# Altium project S32K118_DEVELOPMENT_BOARD.PrjPcb
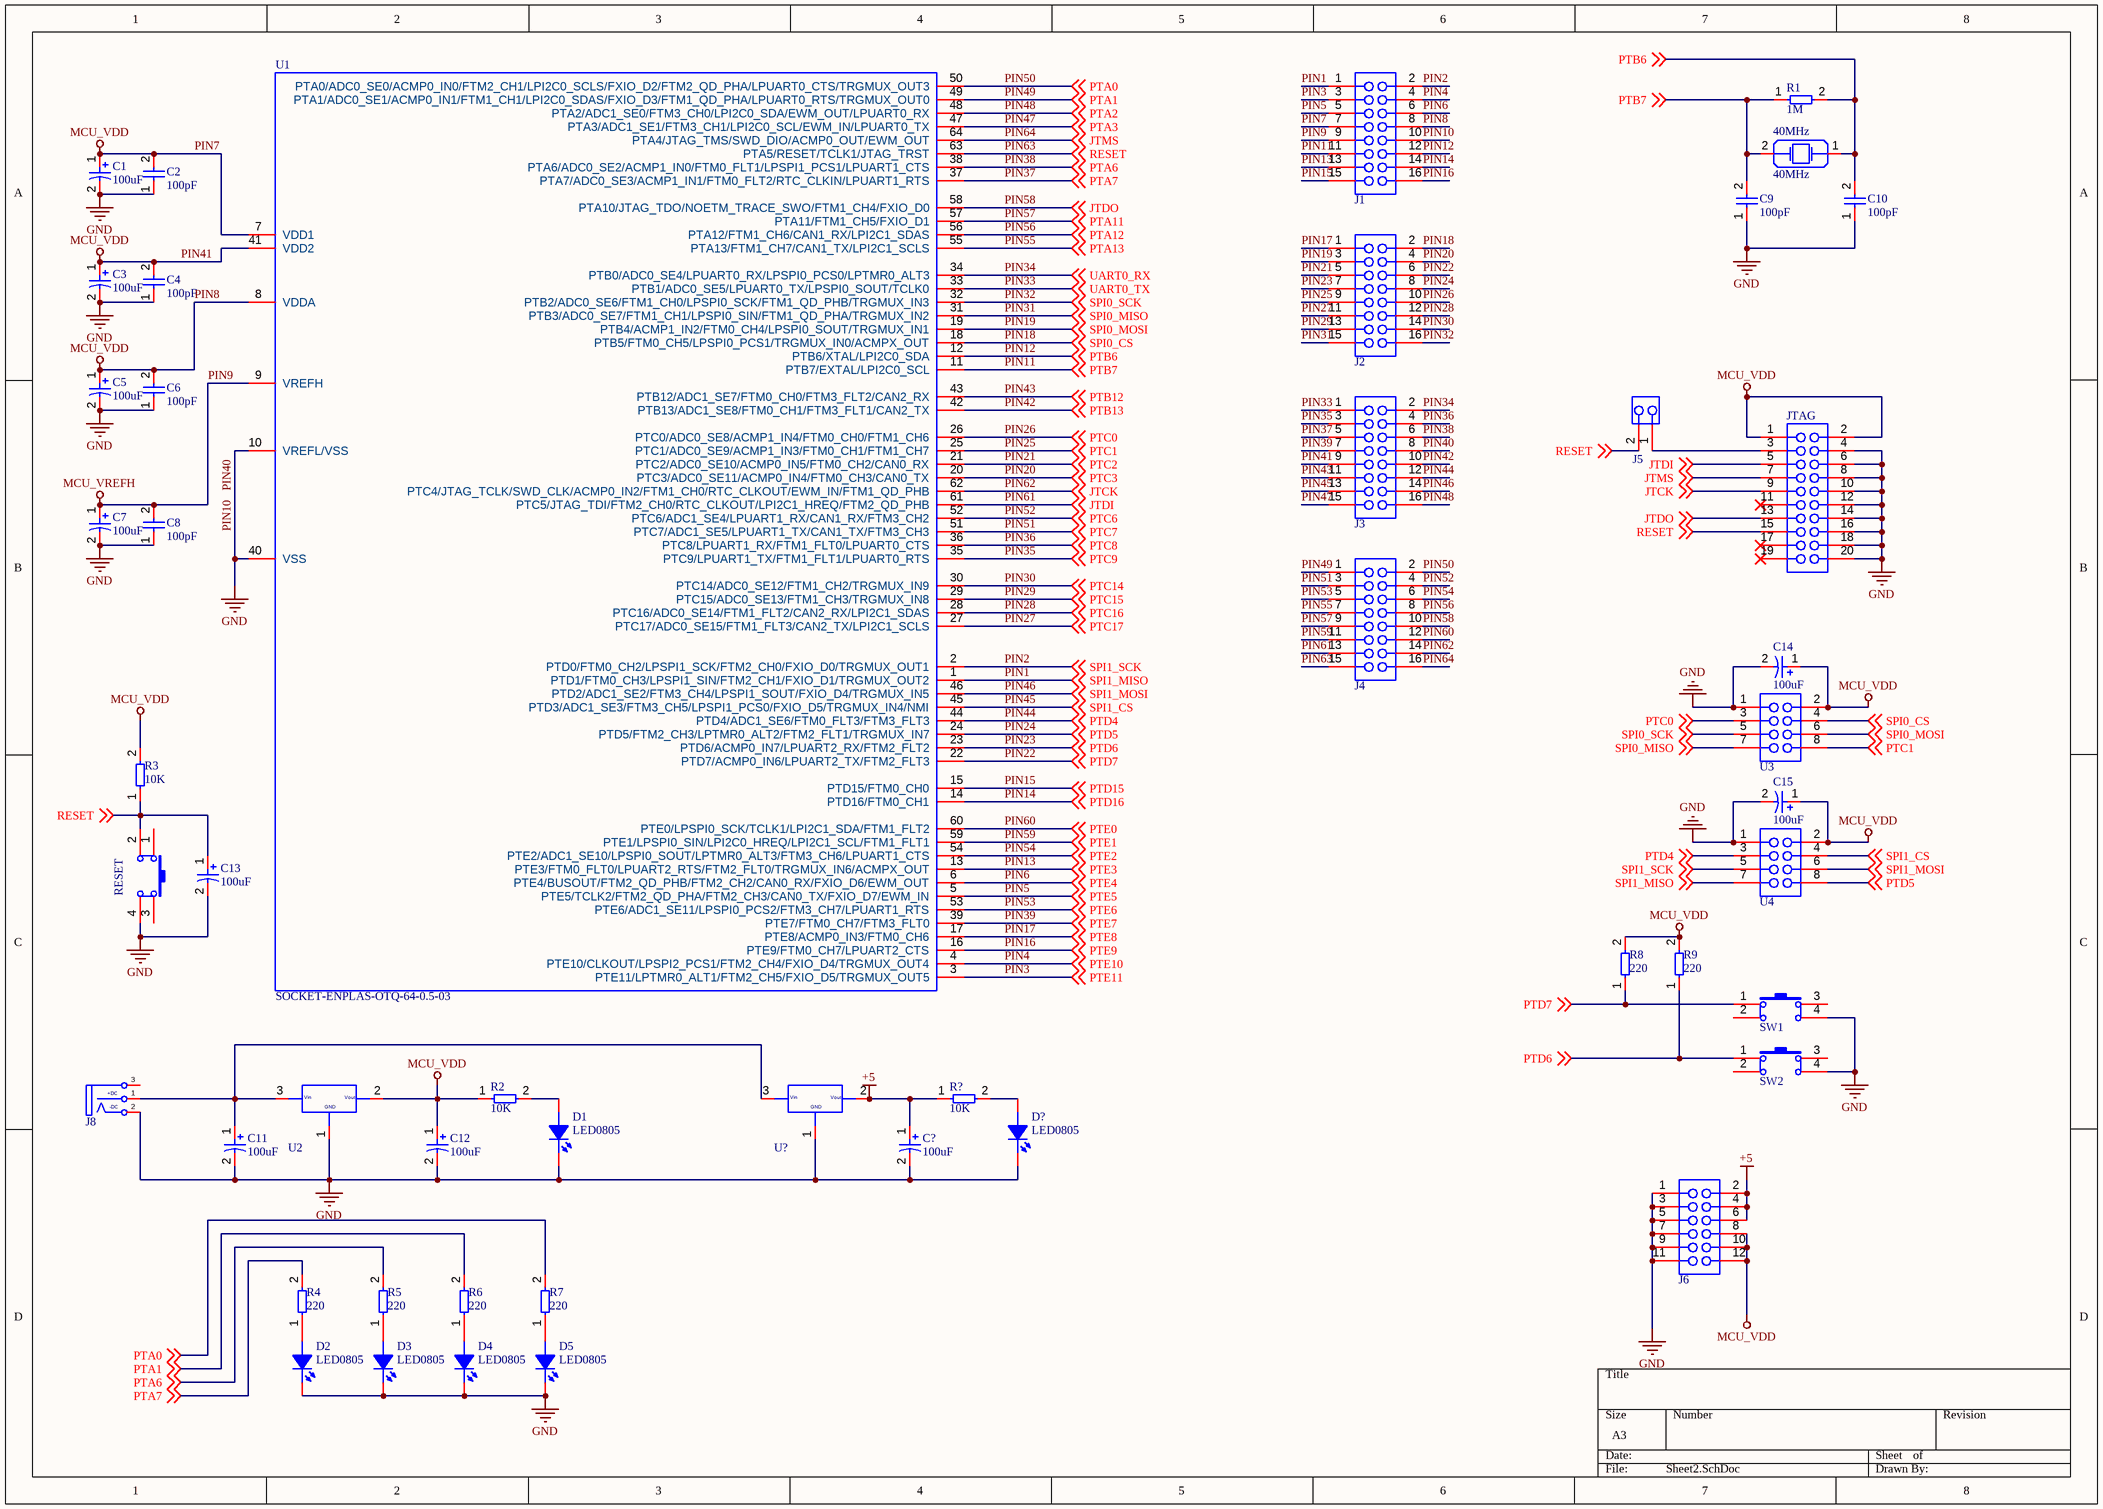
[diagram p0: Sheet2.SchDoc]
1 sheet, 49 parts. Net scope: global (net labels, ports and power ports of the same name join across sheets).
Board file: PCB2.PcbDoc

## Sheet Sheet2.SchDoc
size A3

### Parts
40MHz  40MHz  [HC-49_THROUGH]
C1  100uF  [CAP_RAD_4mm]
C2  100pF  [CAP_DISC_PITCH_2.54MM]
C3  100uF  [CAP_RAD_4mm]
C4  100pF  [CAP_DISC_PITCH_2.54MM]
C5  100uF  [CAP_RAD_4mm]
C6  100pF  [CAP_DISC_PITCH_2.54MM]
C7  100uF  [CAP_RAD_4mm]
C8  100pF  [CAP_DISC_PITCH_2.54MM]
C9  100pF  [CAP_DISC_PITCH_2.54MM]
C10  100pF  [CAP_DISC_PITCH_2.54MM]
C11  100uF  [CAP_RAD_4mm]
C12  100uF  [CAP_RAD_4mm]
C13  100uF  [CAP_RAD_4mm]
C14  100uF  [CAP_RAD_4mm]
C15  100uF  [CAP_RAD_4mm]
C16  100uF  [CAP_RAD_4mm]
D1  LED0805  [L0805RED]
D2  LED0805  [L0805RED]
D3  LED0805  [L0805RED]
D4  LED0805  [L0805RED]
D5  LED0805  [L0805RED]
D6  LED0805  [L0805RED]
J1  Header 8x2 TH Pitch 2.54mm  [Header 8x2 TH Pitch 2.54mm]  (value not drawn)
J2  Header 8x2 TH Pitch 2.54mm  [Header 8x2 TH Pitch 2.54mm]  (value not drawn)
J3  Header 8x2 TH Pitch 2.54mm  [Header 8x2 TH Pitch 2.54mm]  (value not drawn)
J4  Header 8x2 TH Pitch 2.54mm  [Header 8x2 TH Pitch 2.54mm]  (value not drawn)
J5  Header 1x2 TH Pitch 2.54mm  [Header 2x1 TH Pitch 2.54mm]  (value not drawn)
J6  Header 6x2 TH Pitch 2.54mm  [Header 6x2 TH Pitch 2.54mm]  (value not drawn)
J8  Connector  [DC_K375A_Power]  (value not drawn)
JTAG  IDC_2.54_10x2  [IDC_CONNECTOR_20_2.54]  (value not drawn)
R1  1M  [RES-0.25W-H-MF]
R2  10K  [RES-0.25W-H-MF]
R3  10K  [RES-0.25W-H-MF]
R4  220  [R0805]
R5  220  [R0805]
R6  220  [R0805]
R7  220  [R0805]
R8  220  [R0805]
R9  220  [R0805]
R?  10K  [RES-0.25W-H-MF]
RESET  Button Hole  [BUTTON_HOLE_5.0mm]  (value not drawn)
SW1  Button Hole  [BUTTON_HOLE_5.0mm]  (value not drawn)
SW2  Button Hole  [BUTTON_HOLE_5.0mm]  (value not drawn)
U1  SOCKET-ENPLAS-OTQ-64-0.5-03  [SOCKET-ADAPTER-OTQ-64-05-03]
U2  AMS1117  [SOT223-3]  (value not drawn)
U3  nRF24L01  [Header 4x2 TH Pitch 2.54mm]  (value not drawn)
U4  nRF24L01  [Header 4x2 TH Pitch 2.54mm]  (value not drawn)
U5  AMS1117  [SOT223-3]  (value not drawn)

### Nets
+5: C16.1 J6.2 J6.4 J6.6 R?.1 U5.2
PIN9: C7.1 C8.2 J1.9 U1.9(VREFH)  [also labelled MCU_VREFH]
PIN10: C1.2 C2.1 C3.2 C4.1 C5.2 C6.1 C7.2 C8.1 C9.1 C10.1 C11.2 C12.2 C13.2 C14.2 C15.2 C16.2 D1.2(K) D2.2(K) D3.2(K) D4.2(K) D5.2(K) D6.2(K) J1.10 J3.8 J6.1 J6.3 J6.5 J6.7 J6.9 J6.11 J8.2(DC-) JTAG.4 JTAG.6 JTAG.8 JTAG.10 JTAG.12 JTAG.14 JTAG.16 JTAG.18 JTAG.20 RESET.4 SW1.4 SW2.4 U1.10(VREFL/VSS) U1.40(VSS) U2.1 U3.1 U4.1 U5.1  [also labelled GND, PIN40]
PIN41: C1.1 C2.2 C3.1 C4.2 C5.1 C6.2 C12.1 C14.1 C15.1 J1.7 J1.8 J3.9 J6.8 J6.10 J6.12 JTAG.1 JTAG.2 R2.1 R3.2 R8.2 R9.2 U1.7(VDD1) U1.8(VDDA) U1.41(VDD2) U2.2 U3.2 U4.2  [also labelled MCU_VDD, PIN7, PIN8]
PIN1: J1.1 U1.1(PTD1/FTM0_CH3/LPSPI1_SIN/FTM2_CH1/FXIO_D1/TRGMUX_OUT2) U4.7 ; off-sheet SPI1_MISO  [also labelled SPI1_MISO]
PIN2: J1.2 U1.2(PTD0/FTM0_CH2/LPSPI1_SCK/FTM2_CH0/FXIO_D0/TRGMUX_OUT1) U4.5 ; off-sheet SPI1_SCK  [also labelled SPI1_SCK]
PIN3: J1.3 U1.3(PTE11/LPTMR0_ALT1/FTM2_CH5/FXIO_D5/TRGMUX_OUT5) ; off-sheet PTE11  [also labelled PTE11]
PIN4: J1.4 U1.4(PTE10/CLKOUT/LPSPI2_PCS1/FTM2_CH4/FXIO_D4/TRGMUX_OUT4) ; off-sheet PTE10  [also labelled PTE10]
PIN5: J1.5 U1.5(PTE5/TCLK2/FTM2_QD_PHA/FTM2_CH3/CAN0_TX/FXIO_D7/EWM_IN) ; off-sheet PTE5  [also labelled PTE5]
PIN6: J1.6 U1.6(PTE4/BUSOUT/FTM2_QD_PHB/FTM2_CH2/CAN0_RX/FXIO_D6/EWM_OUT) ; off-sheet PTE4  [also labelled PTE4]
PIN11: 40MHz.2 C9.2 J1.11 R1.1 U1.11(PTB7/EXTAL/LPI2C0_SCL) ; off-sheet PTB7  [also labelled PTB7]
PIN12: 40MHz.1 C10.2 J1.12 R1.2 U1.12(PTB6/XTAL/LPI2C0_SDA) ; off-sheet PTB6  [also labelled PTB6]
PIN13: J1.13 U1.13(PTE3/FTM0_FLT0/LPUART2_RTS/FTM2_FLT0/TRGMUX_IN6/ACMPX_OUT) ; off-sheet PTE3  [also labelled PTE3]
PIN14: J1.14 U1.14(PTD16/FTM0_CH1) ; off-sheet PTD16  [also labelled PTD16]
PIN15: J1.15 U1.15(PTD15/FTM0_CH0) ; off-sheet PTD15  [also labelled PTD15]
PIN16: J1.16 U1.16(PTE9/FTM0_CH7/LPUART2_CTS) ; off-sheet PTE9  [also labelled PTE9]
PIN17: J2.1 U1.17(PTE8/ACMP0_IN3/FTM0_CH6) ; off-sheet PTE8  [also labelled PTE8]
PIN18: J2.2 U1.18(PTB5/FTM0_CH5/LPSPI0_PCS1/TRGMUX_IN0/ACMPX_OUT) U3.4 ; off-sheet SPI0_CS  [also labelled SPI0_CS]
PIN19: J2.3 U1.19(PTB4/ACMP1_IN2/FTM0_CH4/LPSPI0_SOUT/TRGMUX_IN1) U3.6 ; off-sheet SPI0_MOSI  [also labelled SPI0_MOSI]
PIN20: J2.4 U1.20(PTC3/ADC0_SE11/ACMP0_IN4/FTM0_CH3/CAN0_TX) ; off-sheet PTC3  [also labelled PTC3]
PIN21: J2.5 U1.21(PTC2/ADC0_SE10/ACMP0_IN5/FTM0_CH2/CAN0_RX) ; off-sheet PTC2  [also labelled PTC2]
PIN22: J2.6 R8.1 SW1.1 U1.22(PTD7/ACMP0_IN6/LPUART2_TX/FTM2_FLT3) ; off-sheet PTD7  [also labelled PTD7]
PIN23: J2.7 R9.1 SW2.1 U1.23(PTD6/ACMP0_IN7/LPUART2_RX/FTM2_FLT2) ; off-sheet PTD6  [also labelled PTD6]
PIN24: J2.8 U1.24(PTD5/FTM2_CH3/LPTMR0_ALT2/FTM2_FLT1/TRGMUX_IN7) U4.8 ; off-sheet PTD5  [also labelled PTD5]
PIN25: J2.9 U1.25(PTC1/ADC0_SE9/ACMP1_IN3/FTM0_CH1/FTM1_CH7) U3.8 ; off-sheet PTC1  [also labelled PTC1]
PIN26: J2.10 U1.26(PTC0/ADC0_SE8/ACMP1_IN4/FTM0_CH0/FTM1_CH6) U3.3 ; off-sheet PTC0  [also labelled PTC0]
PIN27: J2.11 U1.27(PTC17/ADC0_SE15/FTM1_FLT3/CAN2_TX/LPI2C1_SCLS) ; off-sheet PTC17  [also labelled PTC17]
PIN28: J2.12 U1.28(PTC16/ADC0_SE14/FTM1_FLT2/CAN2_RX/LPI2C1_SDAS) ; off-sheet PTC16  [also labelled PTC16]
PIN29: J2.13 U1.29(PTC15/ADC0_SE13/FTM1_CH3/TRGMUX_IN8) ; off-sheet PTC15  [also labelled PTC15]
PIN30: J2.14 U1.30(PTC14/ADC0_SE12/FTM1_CH2/TRGMUX_IN9) ; off-sheet PTC14  [also labelled PTC14]
PIN31: J2.15 U1.31(PTB3/ADC0_SE7/FTM1_CH1/LPSPI0_SIN/FTM1_QD_PHA/TRGMUX_IN2) U3.7 ; off-sheet SPI0_MISO  [also labelled SPI0_MISO]
PIN32: J2.16 U1.32(PTB2/ADC0_SE6/FTM1_CH0/LPSPI0_SCK/FTM1_QD_PHB/TRGMUX_IN3) U3.5 ; off-sheet SPI0_SCK  [also labelled SPI0_SCK]
PIN33: J3.1 U1.33(PTB1/ADC0_SE5/LPUART0_TX/LPSPI0_SOUT/TCLK0) ; off-sheet UART0_TX  [also labelled UART0_TX]
PIN34: J3.2 U1.34(PTB0/ADC0_SE4/LPUART0_RX/LPSPI0_PCS0/LPTMR0_ALT3) ; off-sheet UART0_RX  [also labelled UART0_RX]
PIN35: J3.3 U1.35(PTC9/LPUART1_TX/FTM1_FLT1/LPUART0_RTS) ; off-sheet PTC9  [also labelled PTC9]
PIN36: J3.4 U1.36(PTC8/LPUART1_RX/FTM1_FLT0/LPUART0_CTS) ; off-sheet PTC8  [also labelled PTC8]
PIN37: J3.5 R4.2 U1.37(PTA7/ADC0_SE3/ACMP1_IN1/FTM0_FLT2/RTC_CLKIN/LPUART1_RTS) ; off-sheet PTA7  [also labelled PTA7]
PIN38: J3.6 R5.2 U1.38(PTA6/ADC0_SE2/ACMP1_IN0/FTM0_FLT1/LPSPI1_PCS1/LPUART1_CTS) ; off-sheet PTA6  [also labelled PTA6]
PIN39: J3.7 U1.39(PTE7/FTM0_CH7/FTM3_FLT0) ; off-sheet PTE7  [also labelled PTE7]
PIN42: J3.10 U1.42(PTB13/ADC1_SE8/FTM0_CH1/FTM3_FLT1/CAN2_TX) ; off-sheet PTB13  [also labelled PTB13]
PIN43: J3.11 U1.43(PTB12/ADC1_SE7/FTM0_CH0/FTM3_FLT2/CAN2_RX) ; off-sheet PTB12  [also labelled PTB12]
PIN44: J3.12 U1.44(PTD4/ADC1_SE6/FTM0_FLT3/FTM3_FLT3) U4.3 ; off-sheet PTD4  [also labelled PTD4]
PIN45: J3.13 U1.45(PTD3/ADC1_SE3/FTM3_CH5/LPSPI1_PCS0/FXIO_D5/TRGMUX_IN4/NMI) U4.4 ; off-sheet SPI1_CS  [also labelled SPI1_CS]
PIN46: J3.14 U1.46(PTD2/ADC1_SE2/FTM3_CH4/LPSPI1_SOUT/FXIO_D4/TRGMUX_IN5) U4.6 ; off-sheet SPI1_MOSI  [also labelled SPI1_MOSI]
PIN47: J3.15 U1.47(PTA3/ADC1_SE1/FTM3_CH1/LPI2C0_SCL/EWM_IN/LPUART0_TX) ; off-sheet PTA3  [also labelled PTA3]
PIN48: J3.16 U1.48(PTA2/ADC1_SE0/FTM3_CH0/LPI2C0_SDA/EWM_OUT/LPUART0_RX) ; off-sheet PTA2  [also labelled PTA2]
PIN49: J4.1 R6.2 U1.49(PTA1/ADC0_SE1/ACMP0_IN1/FTM1_CH1/LPI2C0_SDAS/FXIO_D3/FTM1_QD_PHA/LPUART0_RTS/TRGMUX_OUT0) ; off-sheet PTA1  [also labelled PTA1]
PIN50: J4.2 R7.2 U1.50(PTA0/ADC0_SE0/ACMP0_IN0/FTM2_CH1/LPI2C0_SCLS/FXIO_D2/FTM2_QD_PHA/LPUART0_CTS/TRGMUX_OUT3) ; off-sheet PTA0  [also labelled PTA0]
PIN51: J4.3 U1.51(PTC7/ADC1_SE5/LPUART1_TX/CAN1_TX/FTM3_CH3) ; off-sheet PTC7  [also labelled PTC7]
PIN52: J4.4 U1.52(PTC6/ADC1_SE4/LPUART1_RX/CAN1_RX/FTM3_CH2) ; off-sheet PTC6  [also labelled PTC6]
PIN53: J4.5 U1.53(PTE6/ADC1_SE11/LPSPI0_PCS2/FTM3_CH7/LPUART1_RTS) ; off-sheet PTE6  [also labelled PTE6]
PIN54: J4.6 U1.54(PTE2/ADC1_SE10/LPSPI0_SOUT/LPTMR0_ALT3/FTM3_CH6/LPUART1_CTS) ; off-sheet PTE2  [also labelled PTE2]
PIN55: J4.7 U1.55(PTA13/FTM1_CH7/CAN1_TX/LPI2C1_SCLS) ; off-sheet PTA13  [also labelled PTA13]
PIN56: J4.8 U1.56(PTA12/FTM1_CH6/CAN1_RX/LPI2C1_SDAS) ; off-sheet PTA12  [also labelled PTA12]
PIN57: J4.9 U1.57(PTA11/FTM1_CH5/FXIO_D1) ; off-sheet PTA11  [also labelled PTA11]
PIN58: J4.10 JTAG.13 U1.58(PTA10/JTAG_TDO/NOETM_TRACE_SWO/FTM1_CH4/FXIO_D0) ; off-sheet JTDO  [also labelled JTDO]
PIN59: J4.11 U1.59(PTE1/LPSPI0_SIN/LPI2C0_HREQ/LPI2C1_SCL/FTM1_FLT1) ; off-sheet PTE1  [also labelled PTE1]
PIN60: J4.12 U1.60(PTE0/LPSPI0_SCK/TCLK1/LPI2C1_SDA/FTM1_FLT2) ; off-sheet PTE0  [also labelled PTE0]
PIN61: J4.13 JTAG.5 U1.61(PTC5/JTAG_TDI/FTM2_CH0/RTC_CLKOUT/LPI2C1_HREQ/FTM2_QD_PHB) ; off-sheet JTDI  [also labelled JTDI]
PIN62: J4.14 JTAG.9 U1.62(PTC4/JTAG_TCLK/SWD_CLK/ACMP0_IN2/FTM1_CH0/RTC_CLKOUT/EWM_IN/FTM1_QD_PHB) ; off-sheet JTCK  [also labelled JTCK]
PIN63: C13.1 J4.15 J5.2 JTAG.15 R3.1 RESET.2 U1.63(PTA5/RESET/TCLK1/JTAG_TRST) ; off-sheet RESET  [also labelled RESET]
PIN64: J4.16 JTAG.7 U1.64(PTA4/JTAG_TMS/SWD_DIO/ACMP0_OUT/EWM_OUT) ; off-sheet JTMS  [also labelled JTMS]
NetC11_1: C11.1 J8.1(DS+) U2.3 U5.3
NetD1_1: D1.1(A) R2.2
NetD2_1: D2.1(A) R4.1
NetD3_1: D3.1(A) R5.1
NetD4_1: D4.1(A) R6.1
NetD5_1: D5.1(A) R7.1
NetD6_1: D6.1(A) R?.2
NetJ5_1: J5.1 JTAG.3

Not connected (* = marked no-connect by the designer): J8 3(T); JTAG 11* 17* 19*; RESET 1 3; SW1 2 3; SW2 2 3

### Notes on the sheet
- (in symbol AMS1117(SOT-223)) Vin; Vout; GND
- (in symbol JackDC) +DC; -DC

### Library data of the parts
40MHz = Crystal
C1 C3 C5 C7 C11-C16 = Capacitor(Radian)
C2 C4 C6 C8-C10 = Capacitors(Disc)
J8 = JackDC
R1-R3 R? = Resistors THD
R4-R9 = Resistor SMD
U1 = S32K118-SOCKET-ENPLAS-OTQ-64-0.5-03
U2 U5 = AMS1117(SOT-223)
U3 U4 = Header 4x2 TH Pitch 2.54mm